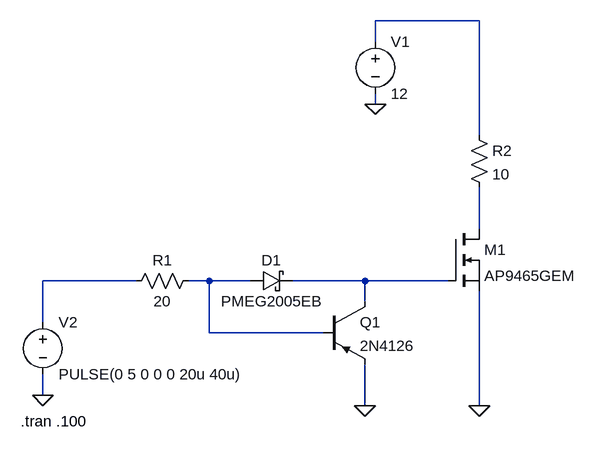
[diagram p0: schematic Draft2.asc]
Draft2.asc, the LTspice schematic file:
Version 4
SHEET 1 880 680
WIRE 288 -192 128 -192
WIRE 128 -160 128 -192
WIRE 128 -64 128 -80
WIRE 288 -16 288 -192
WIRE 288 128 288 64
WIRE -240 208 -384 208
WIRE -128 208 -160 208
WIRE -64 208 -128 208
WIRE 112 208 0 208
WIRE 240 208 112 208
WIRE 112 240 112 208
WIRE -384 272 -384 208
WIRE -128 288 -128 208
WIRE 48 288 -128 288
WIRE -384 384 -384 352
WIRE 112 400 112 336
WIRE 288 400 288 224
FLAG 112 400 0
FLAG 288 400 0
FLAG 128 -64 0
FLAG -384 384 0
SYMBOL nmos 240 128 R0
SYMATTR InstName M1
SYMATTR Value AP9465GEM
SYMBOL pnp 48 240 R0
SYMATTR InstName Q1
SYMATTR Value 2N4126
SYMBOL res -144 192 R90
WINDOW 0 0 56 VBottom 2
WINDOW 3 32 56 VTop 2
SYMATTR InstName R1
SYMATTR Value 20
SYMBOL res 272 -32 R0
SYMATTR InstName R2
SYMATTR Value 10
SYMBOL voltage 128 -176 R0
WINDOW 123 0 0 Left 0
WINDOW 39 0 0 Left 0
SYMATTR InstName V1
SYMATTR Value 12
SYMBOL schottky -64 224 R270
WINDOW 0 32 32 VTop 2
WINDOW 3 0 32 VBottom 2
SYMATTR InstName D1
SYMATTR Value PMEG2005EB
SYMATTR Description Diode
SYMATTR Type diode
SYMBOL voltage -384 256 R0
WINDOW 123 0 0 Left 0
WINDOW 39 0 0 Left 0
SYMATTR InstName V2
SYMATTR Value PULSE(0 5 0 0 0 20u 40u)
TEXT -418 424 Left 2 !.tran .100

The netlist it stands for:
* Draft2.asc
M1 N002 N005 0 0 AP9465GEM
Q1 N005 N004 0 0 2N4126
R1 N004 N003 20
R2 N001 N002 10
V1 N001 0 12
D1 N004 N005 PMEG2005EB
V2 N003 0 PULSE(0 5 0 0 0 20u 40u)
.model D D
.lib standard.dio
.model NPN NPN
.model PNP PNP
.lib standard.bjt
.model NMOS NMOS
.model PMOS PMOS
.lib standard.mos
.tran .100
.backanno
.end